# EAGLE design untitled (EAGLE 9.6.2)
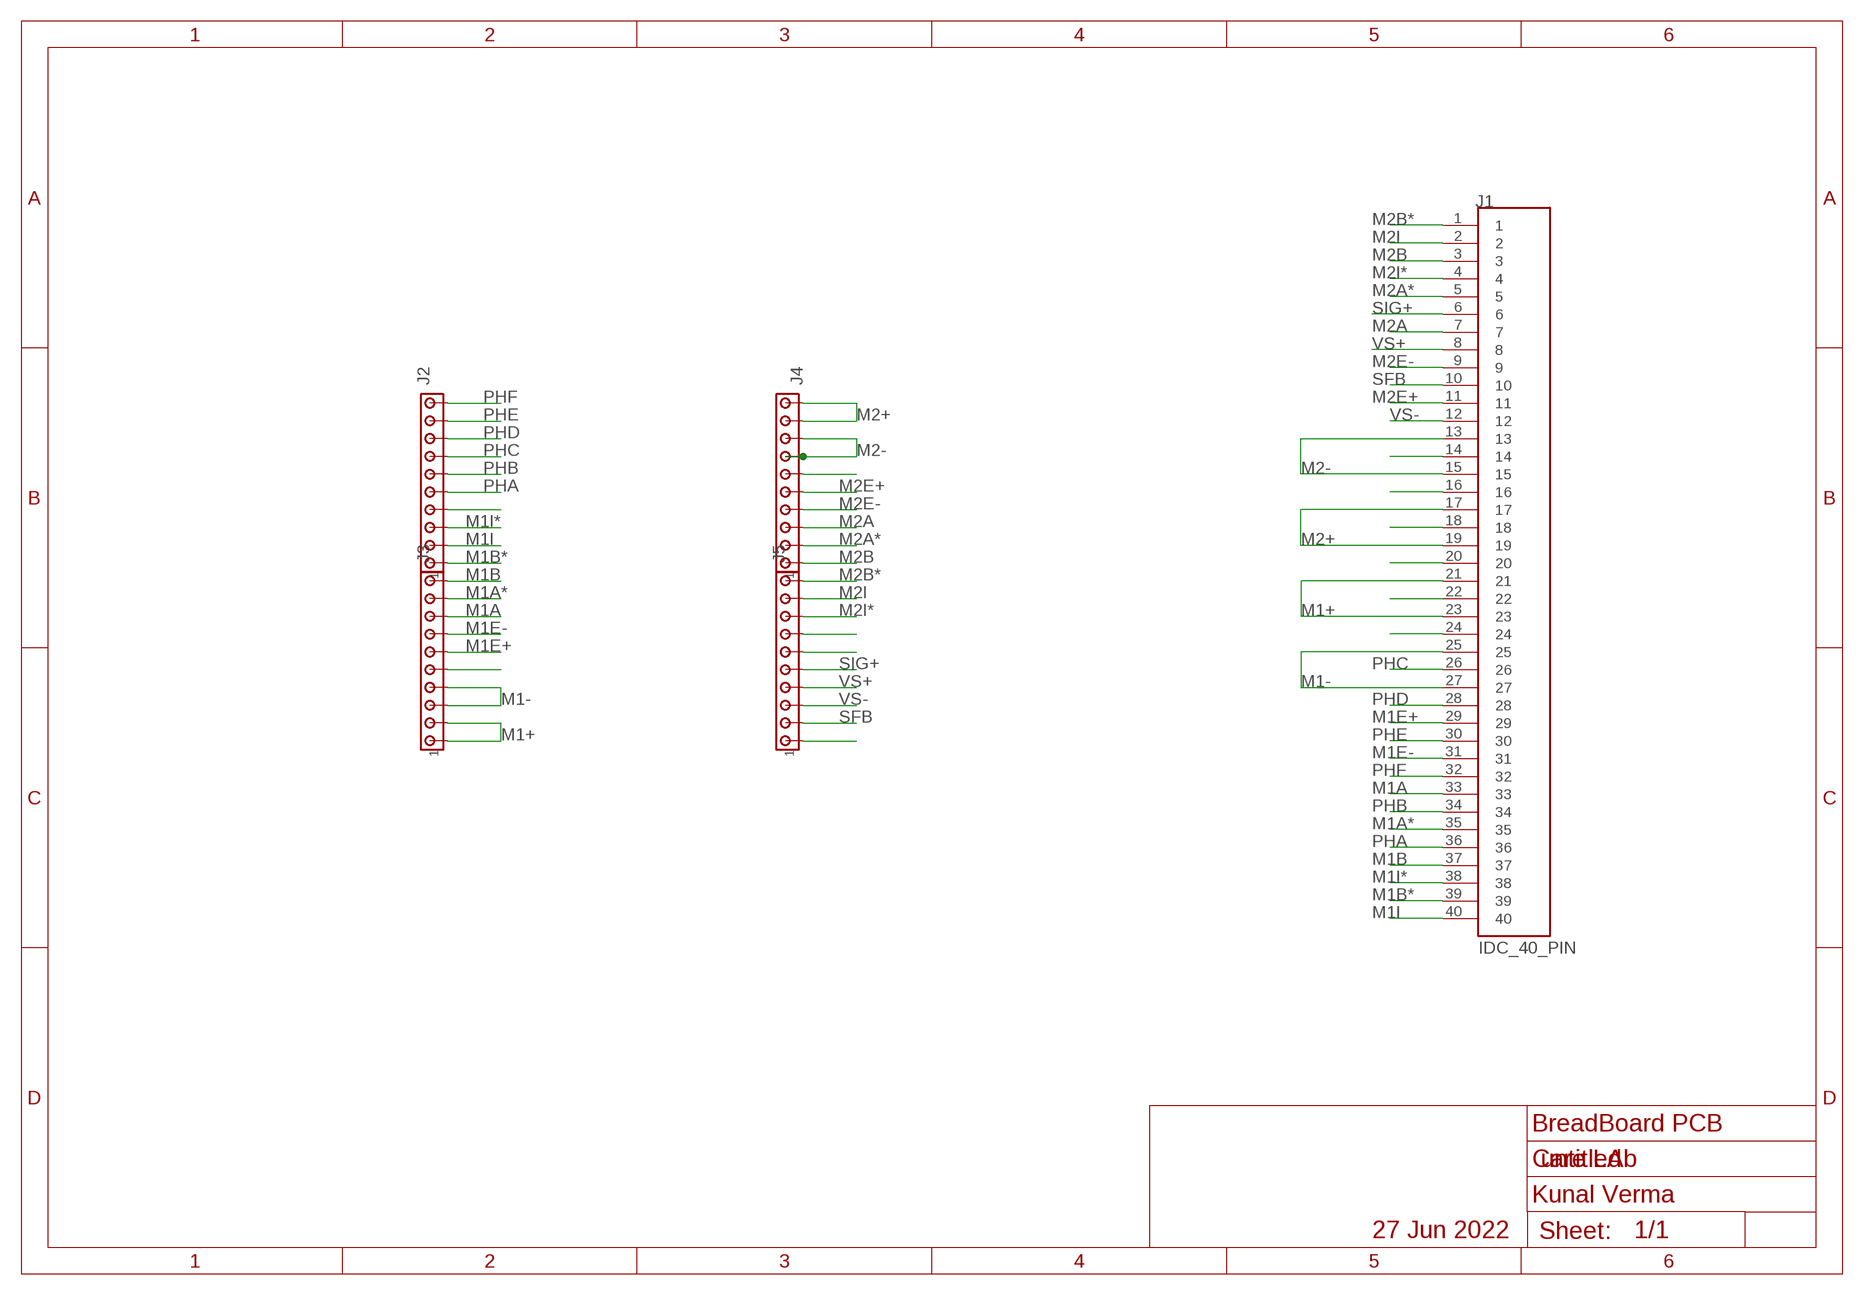
[diagram p0: schematic, sheet 1]

## Parts
J1  IDC_40_PIN  [TE_3-1761605-3]
J2  MTA10-100  [10X10MTA]
J3  MTA10-100  [10X10MTA]
J4  MTA10-100  [10X10MTA]
J5  MTA10-100  [10X10MTA]

## Nets
M1+: J1.21 J1.23 J3.1 J3.2
M1-: J1.25 J1.27 J3.3 J3.4
M1A: J1.33 J3.8
M1A*: J1.35 J3.9
M1B: J1.37 J3.10
M1B*: J1.39 J2.1
M1E+: J1.29 J3.6
M1E-: J1.31 J3.7
M1I: J1.40 J2.2
M1I*: J1.38 J2.3
M2+: J1.17 J1.19 J4.9 J4.10
M2-: J1.13 J1.15 J4.7 J4.8
M2A: J1.7 J4.3
M2A*: J1.5 J4.2
M2B: J1.3 J4.1
M2B*: J1.1 J5.10
M2E+: J1.11 J4.5
M2E-: J1.9 J4.4
M2I: J1.2 J5.9
M2I*: J1.4 J5.8
N$9: J2.4
N$14: J1.14
N$16: J1.16
N$18: J1.18
N$21: J1.22
N$22: J1.20
N$24: J1.24
N$43: J3.5
N$52: J4.6
N$61: J5.7
N$62: J5.6
N$67: J5.1
PHA: J1.36 J2.5
PHB: J1.34 J2.6
PHC: J1.26 J2.7
PHD: J1.28 J2.8
PHE: J1.30 J2.9
PHF: J1.32 J2.10
SFB: J1.10 J5.2
SIG+: J1.6 J5.5
VS+: J1.8 J5.4
VS-: J1.12 J5.3

## Notes on the sheet
- BreadBoard PCB
- Care LAb
- Kunal Verma
- 27 Jun 2022

## Library data of the parts
J1 = 3-1761605-3:IDC_40_PIN: IDC LOW PRO HDR 10P RA BLACK Check availability <https://pricing.snapeda.com/parts/3-1761605-3/TE%20Connectivity/view-part?ref=eda>; AVAILABILITY: In Stock; COMMENT: 3-1761605-3; DESCRIPTION: IDC LOW PRO HDR 40P RA BLUE; EU_ROHS_COMPLIANCE: Compliant; MF: TE Connectivity; MP: 3-1761605-3; PACKAGE: None; PRICE: None; PURCHASE-URL: https://pricing.snapeda.com/search/part/3-1761605-3/?ref=eda
J2-J5 = con-amp:MTA10-100: AMP connector

## Board
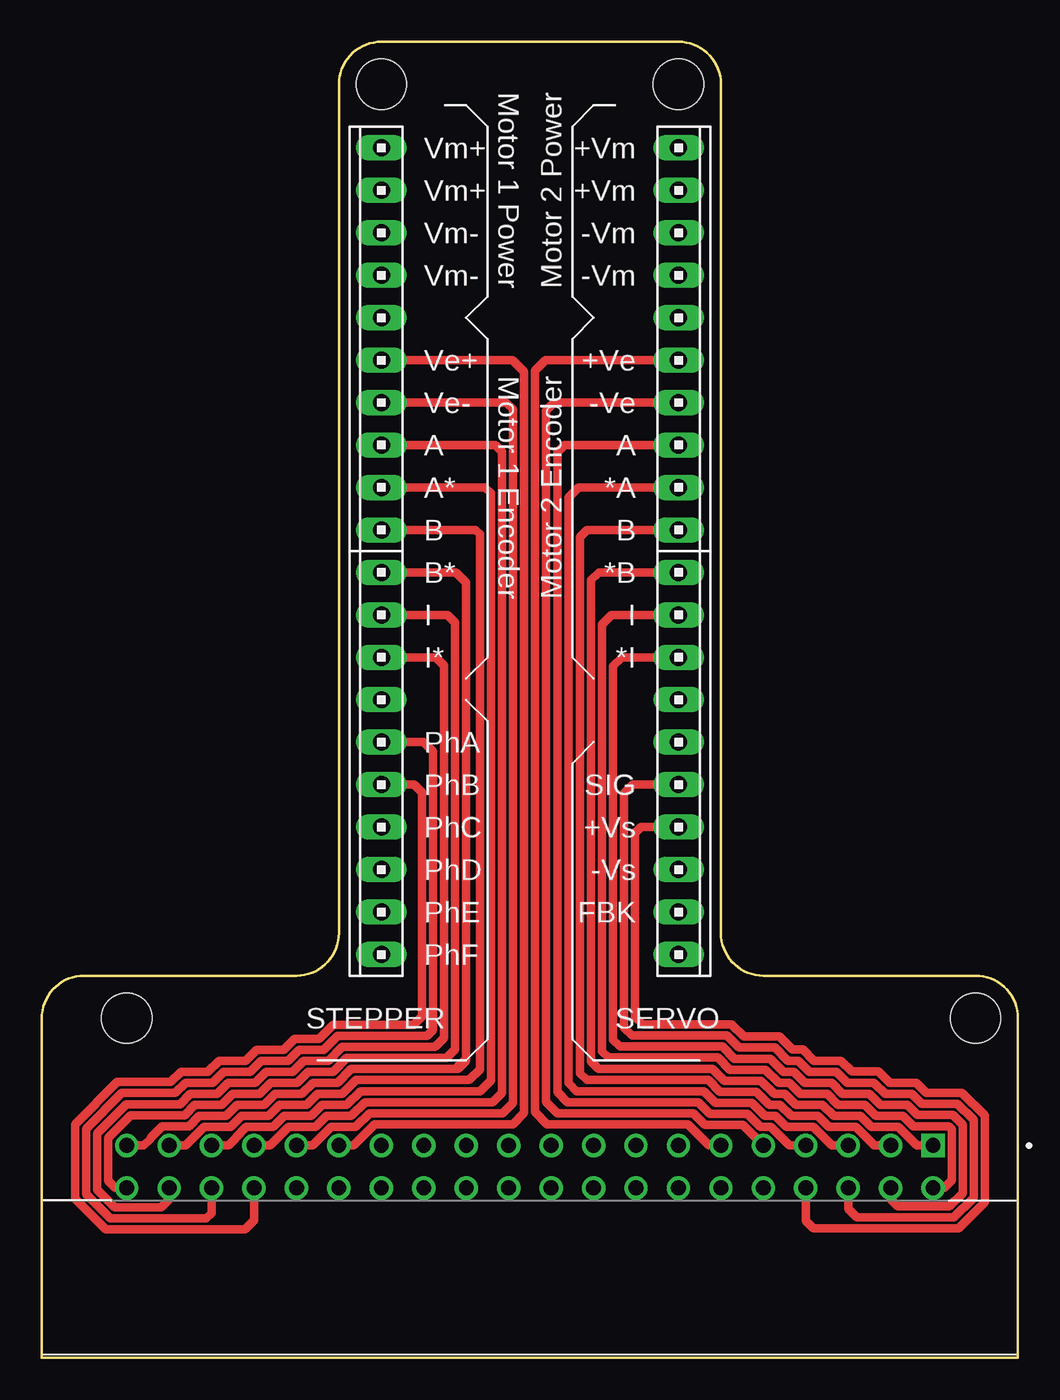
[diagram p1: board, top side]
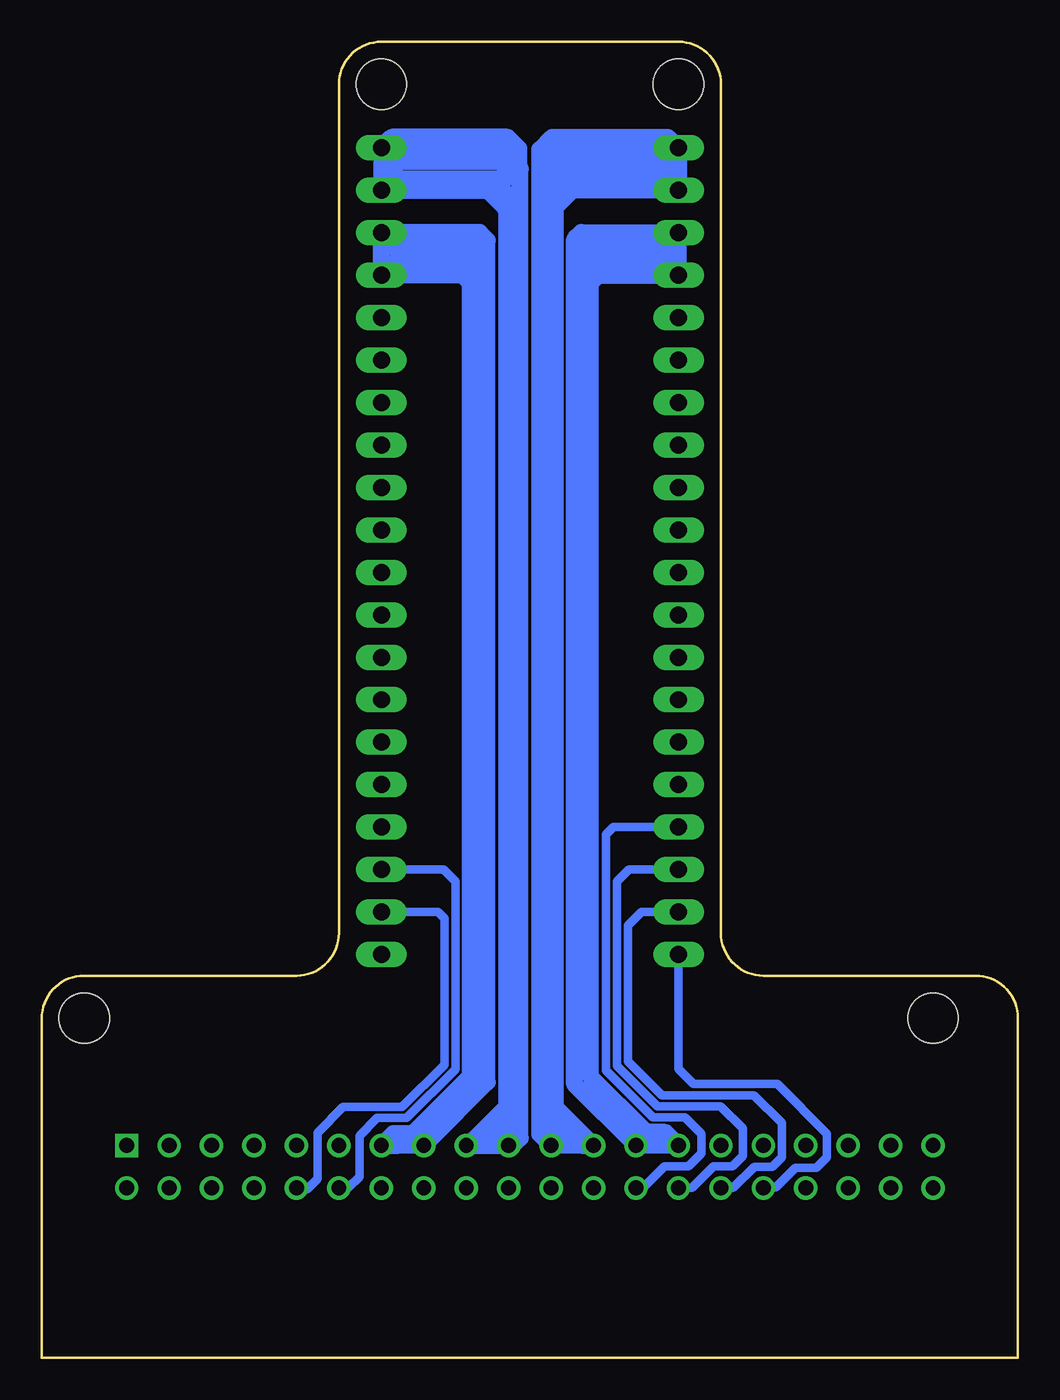
[diagram p2: board, bottom side, seen from below]

Size 58.42 x 78.74 mm. Coordinates in mm from the lower left corner, seen from the top.
Outline: 17.78,25.4 17.78,76.2 arc-90 20.32,78.74 38.1,78.74 arc-90 40.64,76.2 40.64,25.4 arc90 43.18,22.86 55.88,22.86 arc-90 58.42,20.32 58.42,0 0,0 0,20.32 arc-90 2.54,22.86 15.24,22.86 arc90 17.78,25.4
Copper layers (1*16): Top 0.035mm / dielectric 1.5mm / Bottom 0.035mm
Design rules "default": minimum track width 6mil, minimum drill 0.35mm, track to track 6mil, track to pad 6mil, pad to pad 6mil, via to via 6mil, smd to smd 6mil, copper to edge 40mil, drill to drill 6mil, minimum pad ring 10mil, minimum via ring 8mil, stop-mask expansion 4mil, vias tented up to drill 0mil, thermal gap 10mil
Holes 3 mm at 20.32,76.2 38.1,76.2 5.08,20.32 55.88,20.32

### Footprints (pad centres in the part's own frame; a part is rotated, then mirrored left to right if it is on the bottom)
TE_3-1761605-3 = drill 0.89 pad 1.24 square: 1 0,0 | drill 0.89 pad 1.24: 2 0,2.54; 3 2.54,0; 4 2.54,2.54; 5 5.08,0; 6 5.08,2.54; 7 7.62,0; 8 7.62,2.54; 9 10.16,0; 10 10.16,2.54; 11 12.7,0; 12 12.7,2.54; 13 15.24,0; 14 15.24,2.54; 15 17.78,0; 16 17.78,2.54; 17 20.32,0; 18 20.32,2.54; 19 22.86,0; 20 22.86,2.54; 21 25.4,0; 22 25.4,2.54; 23 27.94,0; 24 27.94,2.54; 25 30.48,0; 26 30.48,2.54; 27 33.02,0; 28 33.02,2.54; 29 35.56,0; 30 35.56,2.54; 31 38.1,0; 32 38.1,2.54; 33 40.64,0; 34 40.64,2.54; 35 43.18,0; 36 43.18,2.54; 37 45.72,0; 38 45.72,2.54; 39 48.26,0; 40 48.26,2.54
10X10MTA = drill 1.016 long: 1 11.43,0; 2 8.89,0; 3 6.35,0; 4 3.81,0; 5 1.27,0; 6 -1.27,0; 7 -3.81,0; 8 -6.35,0; 9 -8.89,0; 10 -11.43,0

### Placement (x,y rotation side)
J1  53.34,12.7 180 top
J2  20.32,35.56 90 top
J3  20.32,60.96 90 top
J4  38.1,60.96 270 top
J5  38.1,35.56 270 top

### Tracks (layer width: path | path; a pad name or v marks a point on that pad's centre or on a via)
M1+
  Bottom 1.016: J1.23 J1.21 28.62,13.38 28.62,72.29 27.88,73.02 20.95,73.02 J3.1 | J3.1 J3.2 | J3.2 26.67,69.85 | 26.67,69.85 27.49,69.85 27.7,69.64 | 27.7,69.64 27.7,68.82 | 27.7,15 27.7,68.64 27.7,68.82 | 27.7,15 27.7,14.87 | 27.7,14.87 27.7,13.78 27.27,13.36 26.67,13.36 | 26.67,13.36 26.01,12.7 J1.23 | J1.23 25.99,12.7 27.1,13.8 | 27.16,14.34 27.1,14.27 27.1,13.8 | 26.67,13.36 27.1,13.78 27.1,13.8 | 27.16,14.34 | 27.16,14.34 27.7,14.87 | J1.23 27.7,15 | J3.1 27.25,72.39 27.8,71.84 27.8,69.75 27.7,69.64 | J3.2 21.04,70.57 21.04,71.57 26.71,71.57 27.1,71.17 27.1,70.61 21.33,70.61 | 26.67,69.85 27.7,68.82
M1-
  Bottom 1.016: J3.3 J3.4 25.1,64.77 25.58,64.29 25.58,16.82 22.24,13.48 21.1,13.48 J1.27 J1.25 26.53,16.37 26.53,66.92 26.12,67.32 20.33,67.32 J3.3 | J3.3 21,66.63 21,65.63 25.21,65.63 25.9,64.94 26.52,65.57 26.52,65.91 25.73,66.71 21.75,66.71 21.57,66.54 22.02,66.09 24.85,66.09 25.23,66.47 25.86,65.84
M1A
  Top 0.508: J3.8 27.14,54.61 27.53,54.22 27.53,15.84 26.98,15.29 19.34,15.29 18.52,14.47 17.04,14.47 16.38,13.8 14.78,13.8 13.68,12.7 J1.33
M1A*
  Top 0.508: J3.9 26.52,52.07 26.87,51.72 26.87,16.6 26.22,15.95 19.07,15.95 18.24,15.13 16.77,15.13 16.11,14.47 14.51,14.47 13.85,13.8 12.24,13.8 11.6,13.16 11.6,13.12 11.17,12.7 J1.35
M1B
  Top 0.508: J3.10 25.97,49.53 26.21,49.28 26.21,17.26 25.56,16.61 18.79,16.61 17.97,15.79 16.5,15.79 15.84,15.13 14.24,15.13 13.58,14.47 11.97,14.47 11.31,13.8 9.7,13.8 8.6,12.7 J1.37
M1B*
  Top 0.508: J2.1 24.79,46.99 25.4,46.38 25.4,17.77 | 25.4,17.77 25.24,17.77 24.74,17.27 | 25.4,17.77 24.9,17.27 18.52,17.27 17.7,16.45 16.22,16.45 15.56,15.79 13.96,15.79 13.3,15.13 11.69,15.13 11.03,14.47 9.43,14.47 8.82,13.85 7.21,13.85 6.51,13.16 6.51,13.11 6.11,12.7 J1.39
M1E+
  Top 0.508: J3.6 28.17,59.69 28.85,59 28.85,14.64 28.19,13.97 19.93,13.97 18.66,12.7 J1.29
M1E-
  Top 0.508: J3.7 27.79,57.15 28.19,56.75 28.19,15.26 27.56,14.63 19.61,14.63 18.79,13.8 17.32,13.8 16.21,12.7 J1.31
M1I
  Top 0.508: J2.2 24.27,44.45 24.74,43.98 24.74,18.44 24.23,17.93 18.25,17.93 17.42,17.11 15.95,17.11 15.29,16.45 13.69,16.45 13.03,15.79 11.42,15.79 10.76,15.13 9.15,15.13 8.54,14.51 5.33,14.51 3.97,13.16 3.97,10.57 4.39,10.16 J1.40
M1I*
  Top 0.508: J2.3 23.59,41.91 24.08,41.42 24.08,19.15 23.52,18.59 17.97,18.59 17.15,17.77 15.68,17.77 15.01,17.11 13.41,17.11 12.75,16.45 11.15,16.45 10.49,15.79 8.88,15.79 8.27,15.18 5.06,15.18 3.31,13.43 3.31,10.05 4.37,9 7.15,9 7.62,9.46 J1.38
M2+
  Bottom 1.016: J1.17 J1.19 30.25,12.7 29.79,13.16 29.79,71.13 29.87,71.21 | 29.87,71.21 29.87,72.35 30.54,73.02 37.47,73.02 J4.10 J4.9 31.75,69.85 | 31.75,69.85 30.81,69.85 30.68,69.72 30.68,68.78 | 30.6,15 30.6,68.7 30.68,68.78 | 30.6,15 30.6,13.77 31.1,13.27 32.29,13.27 32.86,12.7 J1.17 | J1.17 32.9,12.7 30.6,15 | 29.87,71.21 30.78,72.12 37.07,72.12 37.34,71.84 37.34,70.55 30.67,70.55 30.67,71.58 36.73,71.58 | 31.75,69.85 30.68,68.78
M2-
  Bottom 1.016: 35.25,13.01 J1.15 J1.13 | 35.25,13.01 31.77,16.5 31.77,66.87 32.22,67.33 38.09,67.33 J4.8 38.1,66.27 | J1.13 37.38,13.42 36.2,13.42 32.75,16.87 32.75,64.29 33.23,64.77 J4.7 | J4.7 38.1,66.27 | J4.7 37.35,65.52 33.19,65.52 | 33.19,65.52 32.56,64.89 32.56,64.86 | 33.19,65.52 32.67,65.52 32.41,65.79 32.41,66.43 32.46,66.48 37.89,66.48 38.1,66.27 | J1.13 37.17,12.7 36.61,13.26 35.49,13.26 35.25,13.01
M2A
  Top 0.508: J4.3 31.27,54.61 30.85,54.19 30.85,15.91 31.47,15.29 39.3,15.29 40,14.59 42.22,14.59 43.01,13.8 43.64,13.8 44.74,12.7 J1.7
M2A*
  Top 0.508: J4.2 32.12,52.07 31.53,51.48 31.53,16.43 32.01,15.95 39.62,15.95 40.32,15.25 42.49,15.25 43.28,14.47 43.91,14.47 44.57,13.8 46.18,13.8 47.28,12.7 J1.5
M2B
  Top 0.508: J4.1 32.62,49.53 32.21,49.12 32.21,17.02 32.62,16.61 39.89,16.61 40.59,15.91 42.77,15.91 43.56,15.13 44.18,15.13 44.84,14.47 46.45,14.47 47.11,13.8 48.72,13.8 49.82,12.7 J1.3
M2B*
  Top 0.508: J5.10 33.34,46.99 32.87,46.52 32.87,17.73 33.3,17.3 40.14,17.3 40.86,16.57 43.04,16.57 43.83,15.79 44.46,15.79 45.12,15.13 46.73,15.13 47.38,14.47 48.99,14.47 49.65,13.8 51.26,13.8 52.36,12.7 J1.1
M2E+
  Top 0.508: J4.5 30.13,59.69 29.51,59.07 29.51,14.7 30.24,13.97 38.66,13.97 39.92,12.7 J1.11
M2E-
  Top 0.508: J4.4 30.64,57.15 30.17,56.69 30.17,15.32 30.86,14.63 38.99,14.63 39.69,13.93 41.95,13.93 J1.9
M2I
  Top 0.508: J5.9 34.1,44.45 33.53,43.87 33.53,18.33 33.91,17.96 40.46,17.96 41.18,17.23 43.31,17.23 44.1,16.45 44.73,16.45 45.39,15.79 47,15.79 47.65,15.13 49.26,15.13 49.93,14.47 51.53,14.47 52.15,13.85 54.27,13.85 54.45,13.68 54.45,10.61 54,10.16 J1.2
M2I*
  Top 0.508: J5.8 34.71,41.91 34.19,41.38 34.19,19.03 34.6,18.62 40.74,18.62 41.46,17.89 43.59,17.89 44.37,17.11 45,17.11 45.67,16.45 47.27,16.45 47.92,15.8 49.53,15.8 50.19,15.13 51.8,15.13 52.39,14.54 54.51,14.54 55.11,13.95 55.11,9.84 54.32,9.05 51.23,9.05 50.8,9.48 J1.4
PHA
  Top 0.508: J2.5 22.85,36.83 23.42,36.26 23.42,19.62 23.05,19.25 17.7,19.25 16.88,18.43 15.4,18.43 14.74,17.77 13.14,17.77 12.48,17.11 10.87,17.11 10.21,16.45 8.61,16.45 8,15.84 4.78,15.84 2.65,13.7 2.65,9.78 4.09,8.34 5.08,8.34 5.44,8.34 9.85,8.34 10.16,8.65 J1.36
PHB
  Top 0.508: J2.6 22.29,34.29 22.76,33.82 22.76,20.43 22.25,19.91 17.43,19.91 16.6,19.09 15.13,19.09 14.47,18.43 12.87,18.43 12.21,17.77 10.6,17.77 9.94,17.11 8.33,17.11 7.72,16.5 4.51,16.5 1.99,13.98 1.99,9.5 3.82,7.68 12.17,7.68 12.7,8.21 J1.34
PHC
  Bottom 0.508: J2.7 24.22,31.75 24.66,31.31 24.66,17.2 21.86,14.39 19.93,14.39 18.93,13.4 18.93,12.24 19.73,11.45 21.16,11.45 22.44,10.16 J1.26
PHD
  Bottom 0.508: J2.8 23.3,29.21 24,28.5 24,17.47 21.58,15.05 17.79,15.05 16.47,13.72 16.47,12.08 17.1,11.45 18.22,11.45 19.5,10.16 J1.28
PHE
  Bottom 0.508: J2.9 22.55,26.67 23.34,25.87 23.34,17.75 21.31,15.71 15.8,15.71 14.13,14.05 14.13,12 14.71,11.43 15.78,11.43 17.05,10.16 J1.30
PHF
  Bottom 0.508: J2.10 20.32,17.27 19.42,16.37 14.41,16.37 11.43,13.39 11.43,12 12.07,11.36 13.32,11.36 14.5,10.18 15.13,10.18 15.15,10.16 J1.32
SFB
  Bottom 0.508: J5.2 34.71,26.67 34.33,26.29 34.33,17.52 36.85,15 40.39,15 41.93,13.46 41.93,10.7 42.54,10.09 43.1,10.09 J1.10
SIG+
  Top 0.508: J5.5 35.37,34.29 34.85,33.77 34.85,19.73 35.31,19.28 41.01,19.28 41.73,18.56 43.86,18.56 44.64,17.77 45.27,17.77 45.94,17.11 47.55,17.11 48.19,16.46 49.8,16.46 50.47,15.79 52.07,15.79 52.66,15.2 54.79,15.2 55.77,14.22 55.77,9.57 54.59,8.39 52.07,8.39 52.01,8.39 48.76,8.39 48.26,8.9 J1.6
VS+
  Top 0.508: J5.4 35.87,31.75 35.51,31.39 35.51,20.4 35.97,19.94 41.28,19.94 42.01,19.22 44.14,19.22 44.92,18.43 45.55,18.43 46.21,17.77 47.82,17.77 48.47,17.12 50.07,17.12 50.74,16.45 52.35,16.45 52.94,15.86 55.06,15.86 56.43,14.5 56.43,9.29 54.87,7.73 46.18,7.73 45.72,8.2 J1.8
VS-
  Bottom 0.508: J5.3 34.37,29.21 33.67,28.51 33.67,17.25 36.58,14.34 38.36,14.34 39.41,13.29 39.41,10.84 40.09,10.16 J1.12

### Text on the board
tPlace: Vm+ | +Vm | Vm+ | Motor 1 Power | Motor 2 Power | +Vm | Vm- | -Vm | Vm- | -Vm | Ve+ | +Ve | Ve- | -Ve | A | A | A* | Motor 1 Encoder | Motor 2 Encoder | *A | B | B | B* | *B | I | I | I* | *I | PhA | PhB | SIG | PhC | +Vs | PhD | -Vs | PhE | FBK | PhF | STEPPER | SERVO